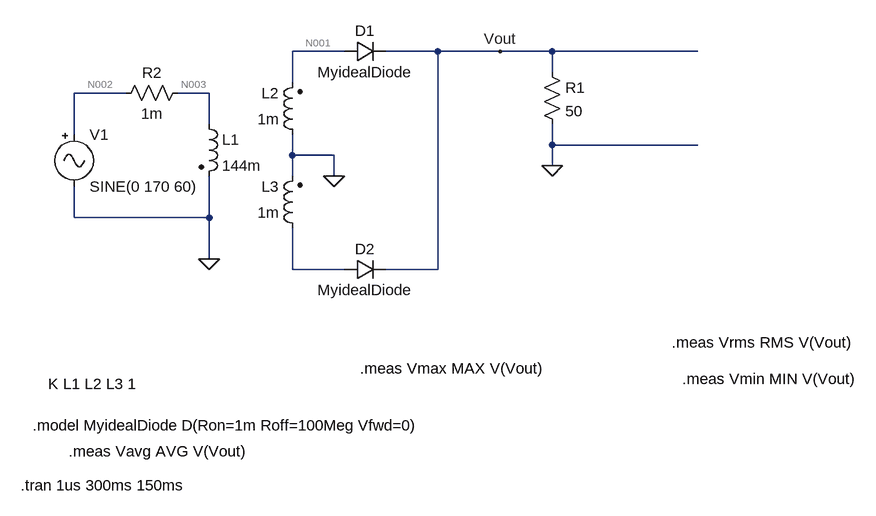
[diagram p0: schematic Lab 5 - Part 3.asc]
Lab 5 - Part 3.asc, the LTspice schematic file:
Version 4
SHEET 1 1224 700
WIRE 416 16 336 16
WIRE 560 16 480 16
WIRE 656 16 560 16
WIRE 736 16 656 16
WIRE 960 16 736 16
WIRE 736 48 736 16
WIRE 336 64 336 16
WIRE 80 80 0 80
WIRE 208 80 160 80
WIRE 208 128 208 80
WIRE 0 144 0 80
WIRE 736 160 736 128
WIRE 960 160 736 160
WIRE 336 176 336 144
WIRE 400 176 336 176
WIRE 736 192 736 160
WIRE 336 208 336 176
WIRE 400 208 400 176
WIRE 0 272 0 224
WIRE 208 272 208 208
WIRE 208 272 0 272
WIRE 208 336 208 272
WIRE 336 352 336 288
WIRE 416 352 336 352
WIRE 560 352 560 16
WIRE 560 352 480 352
FLAG 208 336 0
FLAG 656 16 Vout
FLAG 400 208 0
FLAG 736 192 0
SYMBOL res 176 64 R90
WINDOW 0 0 56 VBottom 2
WINDOW 3 32 56 VTop 2
SYMATTR InstName R2
SYMATTR Value 1m
SYMBOL ind2 192 112 R0
SYMATTR InstName L1
SYMATTR Value 144m
SYMBOL ind2 352 160 R180
WINDOW 0 36 80 Left 2
WINDOW 3 36 40 Left 2
SYMATTR InstName L2
SYMATTR Value 1m
SYMBOL diode 416 32 R270
WINDOW 0 32 32 VTop 2
WINDOW 3 0 32 VBottom 2
SYMATTR InstName D1
SYMATTR Value MyidealDiode
SYMBOL res 720 32 R0
SYMATTR InstName R1
SYMATTR Value 50
SYMBOL Misc\\signal 0 128 R0
WINDOW 123 0 0 Left 0
WINDOW 39 0 0 Left 0
SYMATTR InstName V1
SYMATTR Value SINE(0 170 60)
SYMBOL ind2 352 304 R180
WINDOW 0 36 80 Left 2
WINDOW 3 36 40 Left 2
SYMATTR InstName L3
SYMATTR Value 1m
SYMBOL diode 416 368 R270
WINDOW 0 32 32 VTop 2
WINDOW 3 0 32 VBottom 2
SYMATTR InstName D2
SYMATTR Value MyidealDiode
TEXT -8 632 Left 2 !.meas Vavg AVG V(Vout)
TEXT -82 684 Left 2 !.tran 1us 300ms 150ms
TEXT -64 592 Left 2 !.model MyidealDiode D(Ron=1m Roff=100Meg Vfwd=0)
TEXT -40 528 Left 2 !K L1 L2 L3 1
TEXT 440 504 Left 2 !.meas Vmax MAX V(Vout)
TEXT 920 464 Left 2 !.meas Vrms RMS V(Vout)
TEXT 936 520 Left 2 !.meas Vmin MIN V(Vout)

The netlist it stands for:
* Lab 5 - Part 3.asc
R2 N003 N002 1m
L1 N003 0 144m
L2 0 N001 1m
D1 N001 Vout MyidealDiode
R1 Vout 0 50
V1 N002 0 SINE(0 170 60)
L3 N004 0 1m
D2 N004 Vout MyidealDiode
.model D D
.lib standard.dio
.meas Vavg AVG V(Vout)
.tran 1us 300ms 150ms
.model MyidealDiode D(Ron=1m Roff=100Meg Vfwd=0)
K L1 L2 L3 1
.meas Vmax MAX V(Vout)
.meas Vrms RMS V(Vout)
.meas Vmin MIN V(Vout)
.backanno
.end

* Results of the author's LTspice run, read from the files saved beside the schematic
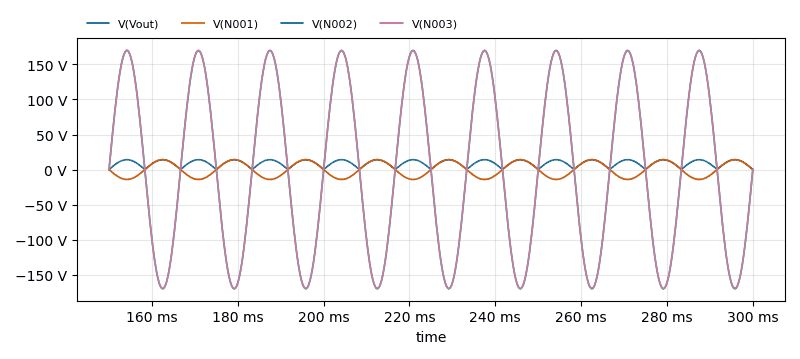
[diagram p1: Transient Analysis of Lab 5 - Part 3.asc, plotted from the saved traces]
* Transient Analysis, 1 run:
*   V(Vout): min 0 V, max 14.17 V, average 9.017 V, rms 9.992 V, last 0 V
*   V(N001): min -14.17 V, max 14.17 V, average -610 µV, rms 9.99 V, last 0 V
*   V(N002): min -170 V, max 170 V, average 2.325 mV, rms 120.2 V, last 0 V
*   V(N003): min -170 V, max 170 V, average 7.319 mV, rms 119.9 V, last 0 V
* From the log:
*   vavg: AVG(v(vout))=9.01663 FROM 0 TO 0.15
*   vmax: MAX(v(vout))=14.1654 FROM 0 TO 0.15
*   vrms: RMS(v(vout))=9.98379 FROM 0 TO 0.15
*   vmin: MIN(v(vout))=1.0232e-07 FROM 0 TO 0.15